# EAGLE schematic Quad_ESC (EAGLE 9.6.2)
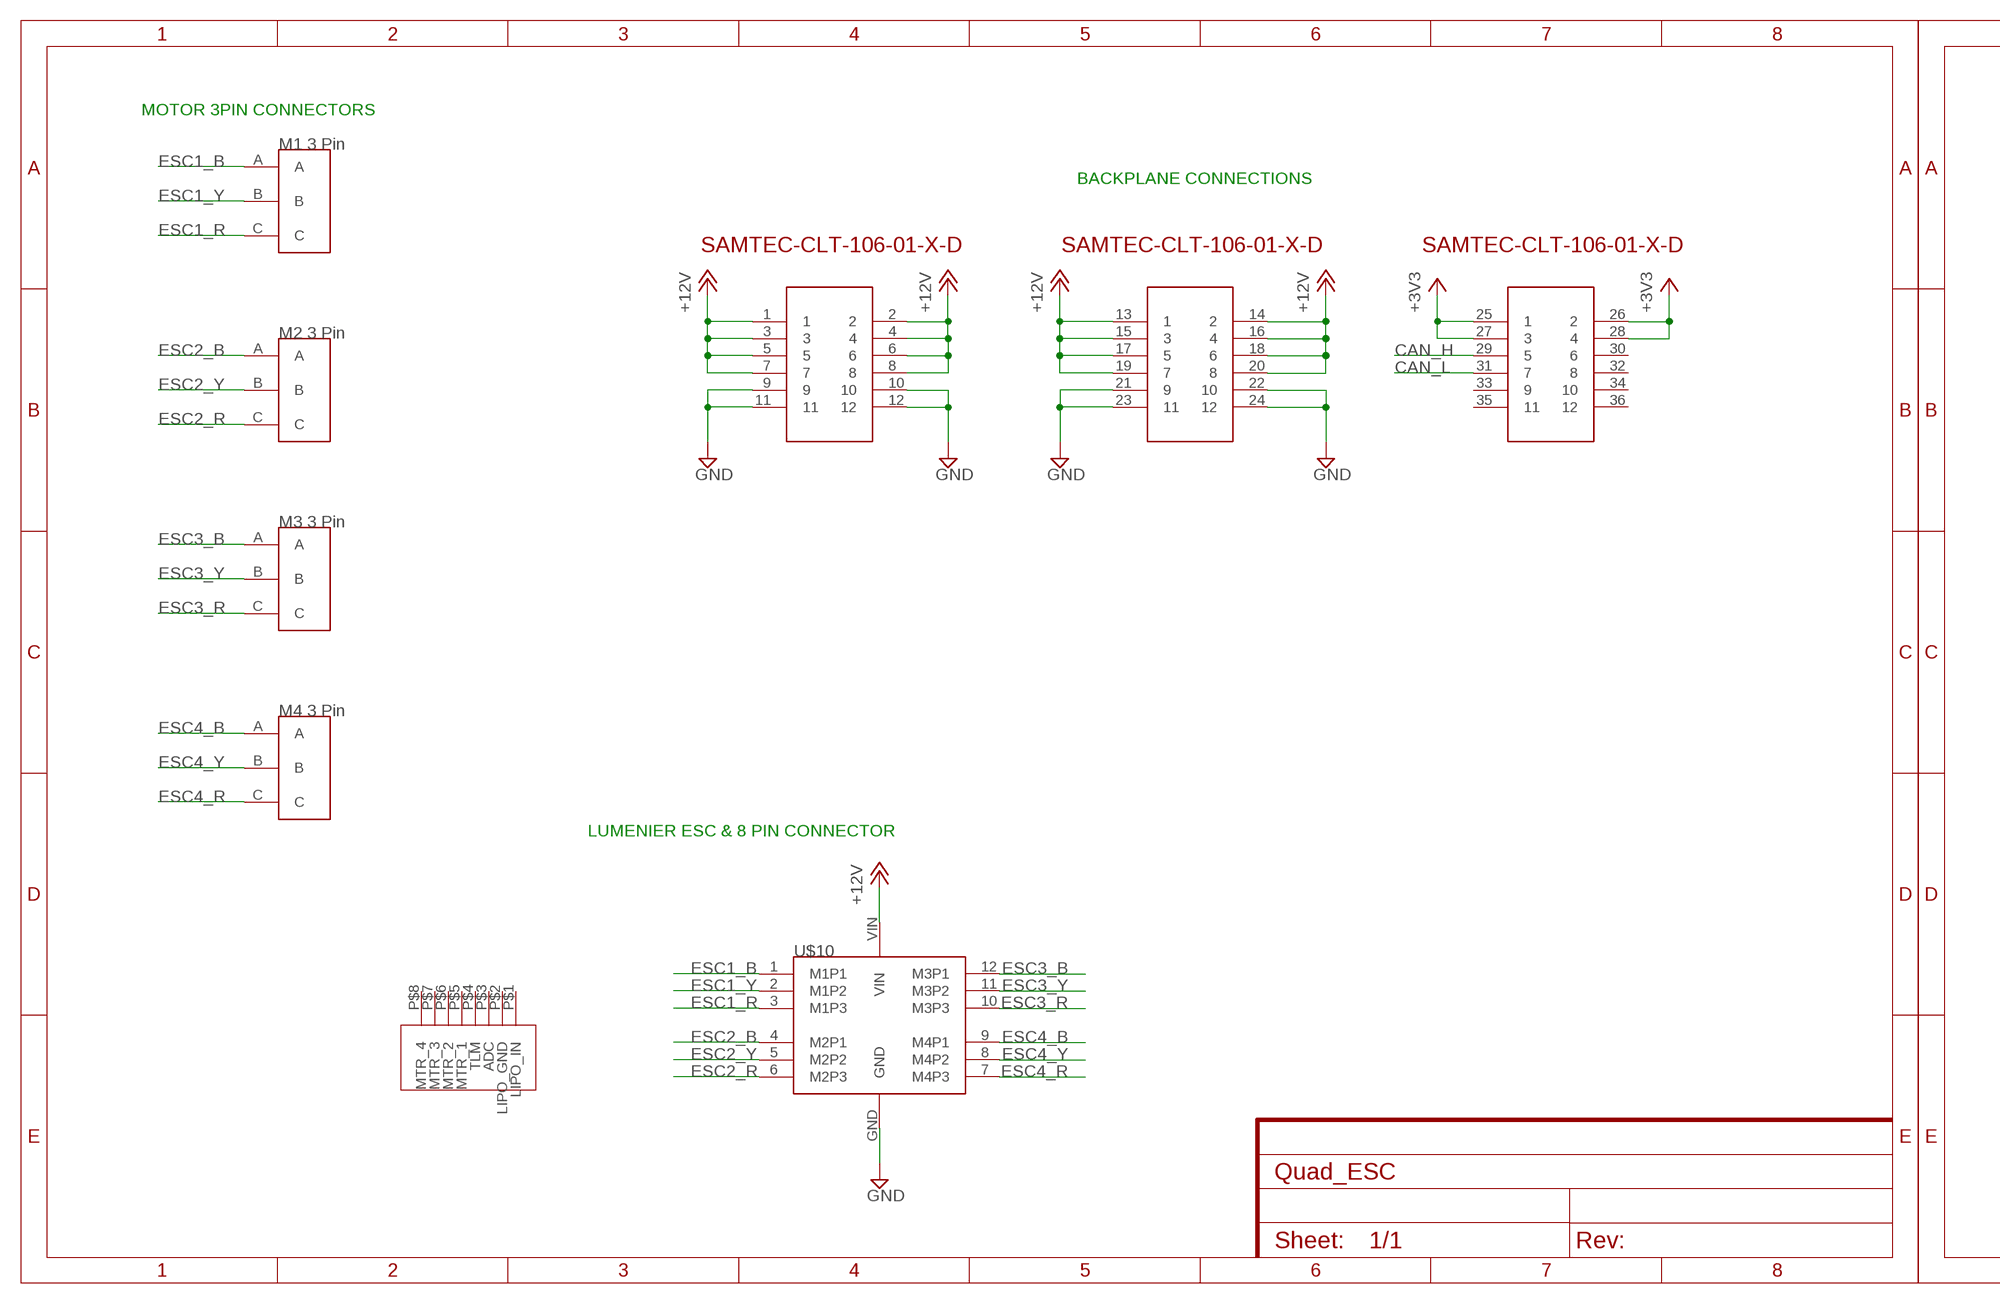
[diagram p0: schematic, sheet 1, part 1 of 2]
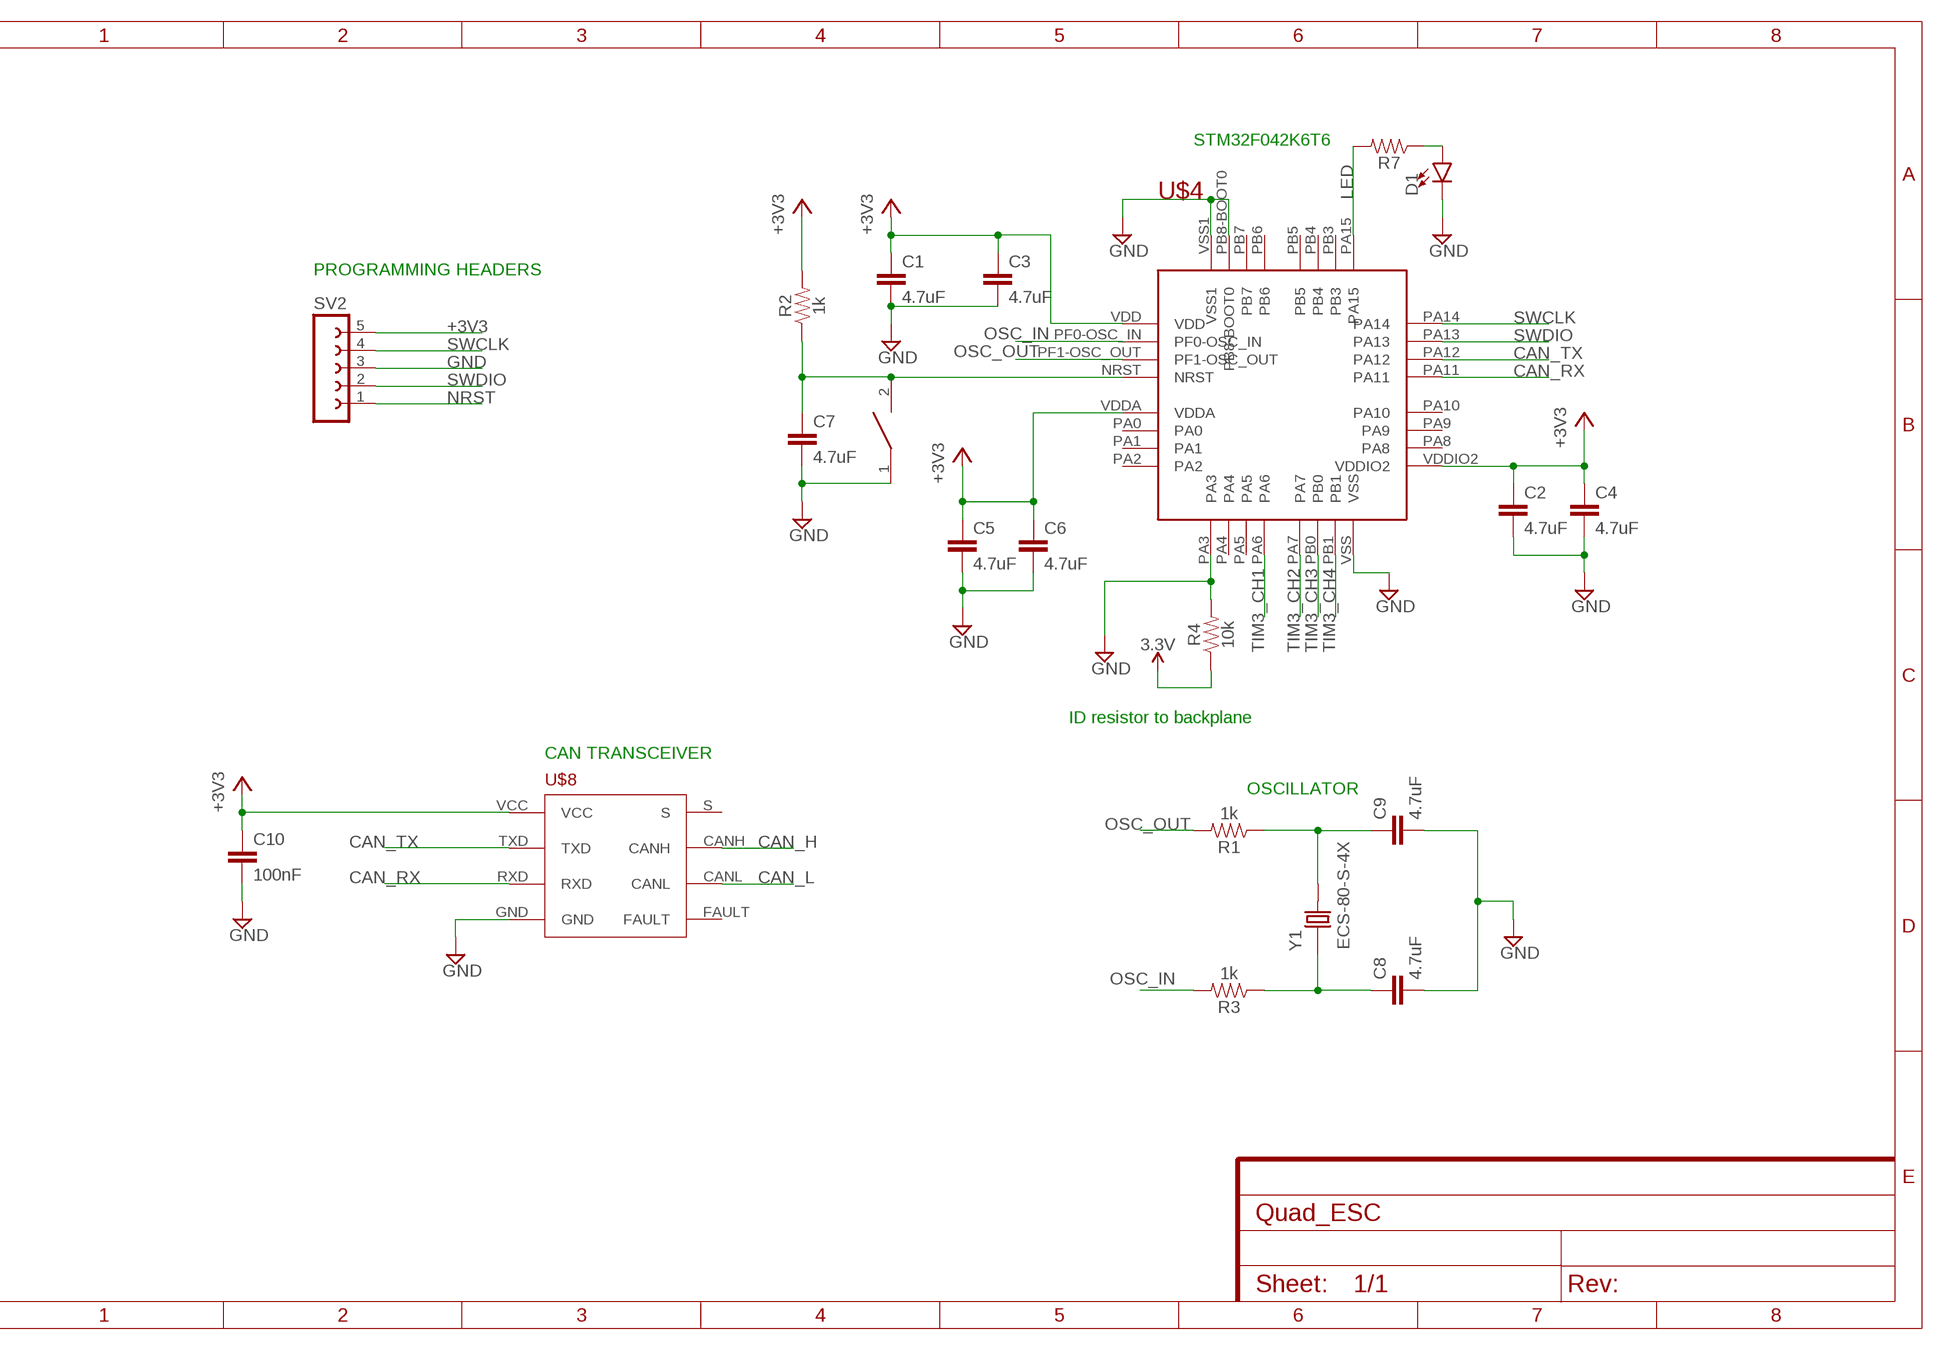
[diagram p1: schematic, sheet 1, part 2 of 2]

## Parts
C1  4.7uF  4.7UF0603  [0603]
C2  4.7uF  4.7UF0603  [0603]
C3  4.7uF  4.7UF0603  [0603]
C4  4.7uF  4.7UF0603  [0603]
C5  4.7uF  4.7UF0603  [0603]
C6  4.7uF  4.7UF0603  [0603]
C7  4.7uF  4.7UF0603  [0603]
C8  4.7uF  4.7UF0603  [0603]
C9  4.7uF  4.7UF0603  [0603]
C10  100nF  4.7UF0603  [0603]
D1  LED0603  [LED-0603]
R1  1k  1KOHM-0603-1/10W-1%  [0603]
R2  1k  1KOHM-0603-1/10W-1%  [0603]
R3  1k  1KOHM-0603-1/10W-1%  [0603]
R4  10k  10KOHM-0603-1/10W-1%  [0603]
R7  RESISTOR0603  [0603]
RESET  SWITCH  [SW_2512]
SV2  FE05-1  [FE05-1]
U$1  3PINCONNECTOR  [3PINCONNECTOR]
U$2  8PIN_CONNECTOR  [8PI_CONNECTOR]
U$3  BACKPLANE_CONNECTORS  [BACKPLANE_CONNECTORS]
U$4  STM32F042K6T6  [STM32F042K6T6]
U$5  3PINCONNECTOR  [3PINCONNECTOR]
U$6  3PINCONNECTOR  [3PINCONNECTOR]
U$7  3PINCONNECTOR  [3PINCONNECTOR]
U$8  TCAN337D  [TCAN337D]
U$10  LUMENIER_QUAD  [LUMENIER_QUAD]
Y1  ECS-80-S-4X  [XTAL_ECS-80-S-4X]

## Nets
3.3V: R4.1
+3V3: C1.1 C2.1 C3.1 C4.1 C5.1 C6.1 C10.1 R2.2 SV2.5 U$3.25 U$3.26 U$3.27 U$3.28 U$4.VDD U$4.VDDA U$4.VDDIO2 U$8.VCC
+12V: U$3.1 U$3.2 U$3.3 U$3.4 U$3.5 U$3.6 U$3.7 U$3.8 U$3.13 U$3.14 U$3.15 U$3.16 U$3.17 U$3.18 U$3.19 U$3.20 U$10.VIN
CAN_H: U$3.29 U$8.CANH
CAN_L: U$3.31 U$8.CANL
CAN_RX: U$4.PA11 U$8.RXD
CAN_TX: U$4.PA12 U$8.TXD
ESC1_B: U$1.A U$10.1(M1P1)
ESC1_R: U$1.C U$10.3(M1P3)
ESC1_Y: U$1.B U$10.2(M1P2)
ESC2_B: U$5.A U$10.4(M2P1)
ESC2_R: U$5.C U$10.6(M2P3)
ESC2_Y: U$5.B U$10.5(M2P2)
ESC3_B: U$6.A U$10.12(M3P1)
ESC3_R: U$6.C U$10.10(M3P3)
ESC3_Y: U$6.B U$10.11(M3P2)
ESC4_B: U$7.A U$10.9(M4P1)
ESC4_R: U$7.C U$10.7(M4P3)
ESC4_Y: U$7.B U$10.8(M4P2)
GND: C1.2 C2.2 C3.2 C4.2 C5.2 C6.2 C7.2 C8.2 C9.2 C10.2 D1.C R4.2 RESET.1 SV2.3 U$3.9 U$3.10 U$3.11 U$3.12 U$3.21 U$3.22 U$3.23 U$3.24 U$4.PA3 U$4.PB8-BOOT0 U$4.VSS U$4.VSS1 U$8.GND U$10.GND
LED: R7.2 U$4.PA15
N$1: C9.1 R1.1 Y1.2
N$2: C8.1 R3.1 Y1.1
N$24: D1.A R7.1
NRST: SV2.1
NRST1: C7.1 R2.1 RESET.2 U$4.NRST
OSC_IN: R3.2 U$4.PF0-OSC_IN
OSC_OUT: R1.2 U$4.PF1-OSC_OUT
SWCLK: SV2.4 U$4.PA14
SWDIO: SV2.2 U$4.PA13
TIM3_CH1: U$4.PA6
TIM3_CH2: U$4.PA7
TIM3_CH3: U$4.PB0
TIM3_CH4: U$4.PB1
Unconnected: U$2.P$1(LIPO_IN) U$2.P$2(LIPO_GND) U$2.P$3(ADC) U$2.P$4(TLM) U$2.P$5(MTR_1) U$2.P$6(MTR_2) U$2.P$7(MTR_3) U$2.P$8(MTR_4) U$3.30 U$3.32 U$3.33 U$3.34 U$3.35 U$3.36 U$4.PA0 U$4.PA1 U$4.PA2 U$4.PA4 U$4.PA5 U$4.PA8 U$4.PA9 U$4.PA10 U$4.PB3 U$4.PB4 U$4.PB5 U$4.PB6 U$4.PB7 U$8.FAULT U$8.S

## Notes on the sheet
- MOTOR 3PIN CONNECTORS
- STM32F042K6T6
- M1 3 Pin
- BACKPLANE CONNECTIONS
- PROGRAMMING HEADERS
- M2 3 Pin
- M3 3 Pin
- ID resistor to backplane
- M4 3 Pin
- CAN TRANSCEIVER
- OSCILLATOR
- LUMENIER ESC & 8 PIN CONNECTOR

## Library data of the parts
C1-C9 = SparkFun-Capacitors:4.7UF: 4.7µF ceramic capacitors A capacitor is a passive two-terminal electrical component used to store electrical energy temporarily in an electric field.; PROD_ID: CAP-08280
C10 = SparkFun-Capacitors:4.7UF: 4.7µF ceramic capacitors A capacitor is a passive two-terminal electrical component used to store electrical energy temporarily in an electric field.; PROD_ID: CAP-08280; VALUE: 4.7uF
D1 = SparkFun-LED:LED: LED (Generic) Standard schematic elements and footprints for 5mm, 3mm, 1206, and 0603 sized LEDs. Generic LEDs with no color specified.
R1-R3 = SparkFun-Resistors:1KOHM: 1kΩ resistor A resistor is a passive two-terminal electrical component that implements electrical resistance as a circuit element. Resistors act to reduce current flow, and, at the same time, act to lower voltage levels within circuits. - Wikipedia; PROD_ID: RES-07856
R4 = SparkFun-Resistors:10KOHM: 10kΩ resistor A resistor is a passive two-terminal electrical component that implements electrical resistance as a circuit element. Resistors act to reduce current flow, and, at the same time, act to lower voltage levels within circuits. - Wikipedia; PROD_ID: RES-00824
R7 = SparkFun-Resistors:RESISTOR: Generic Resistor Package
RESET = DiscreteComponents:SWITCH
SV2 = con-lsta:FE05-1: FEMALE HEADER; OC_FARNELL: unknown; OC_NEWARK: unknown
U$1 U$5-U$7 = BLHeli_32 45A:3PINCONNECTOR
U$2 = BLHeli_32 45A:8PIN_CONNECTOR
U$3 = BLHeli_32 45A:BACKPLANE_CONNECTORS
U$4 = PI_Shield_Library:STM32F042K6T6
U$8 = PI_Shield_Library:TCAN337D
U$10 = BLHeli_32 45A:LUMENIER_QUAD
Y1 = ECS-80-S-4X:ECS-80-S-4X: CRYSTAL T/H; DESCRIPTION: Crystal 8MHz Series 2-Pin HC-49/U; DIGI-KEY_PART_NUMBER: X1057-ND; DIGI-KEY_PURCHASE_URL: https://www.digikey.com/product-detail/en/ecs-inc/ECS-80-S-4X/X1057-ND/827549?utm_source=snapeda&utm_medium=aggregator&utm_campaign=symbol; MF: ECS International; MP: ECS-80-S-4X; PACKAGE: HC-49/US ECS International